# Altium schematic sheet 2_Button & Power.schdoc
size 497 x 243 mm; Name: A_A4; Symbol: A_A4; Device: A_Customize; @Project Name: Arduboy GamePlayer - Button &amp; Power; REV: 5.0; Date: 2022-04-23; Sheet: 2 /3; Draw By: LiLinBai; Company: FastLab Team; Convert to PCB: yes; Add into BOM: yes
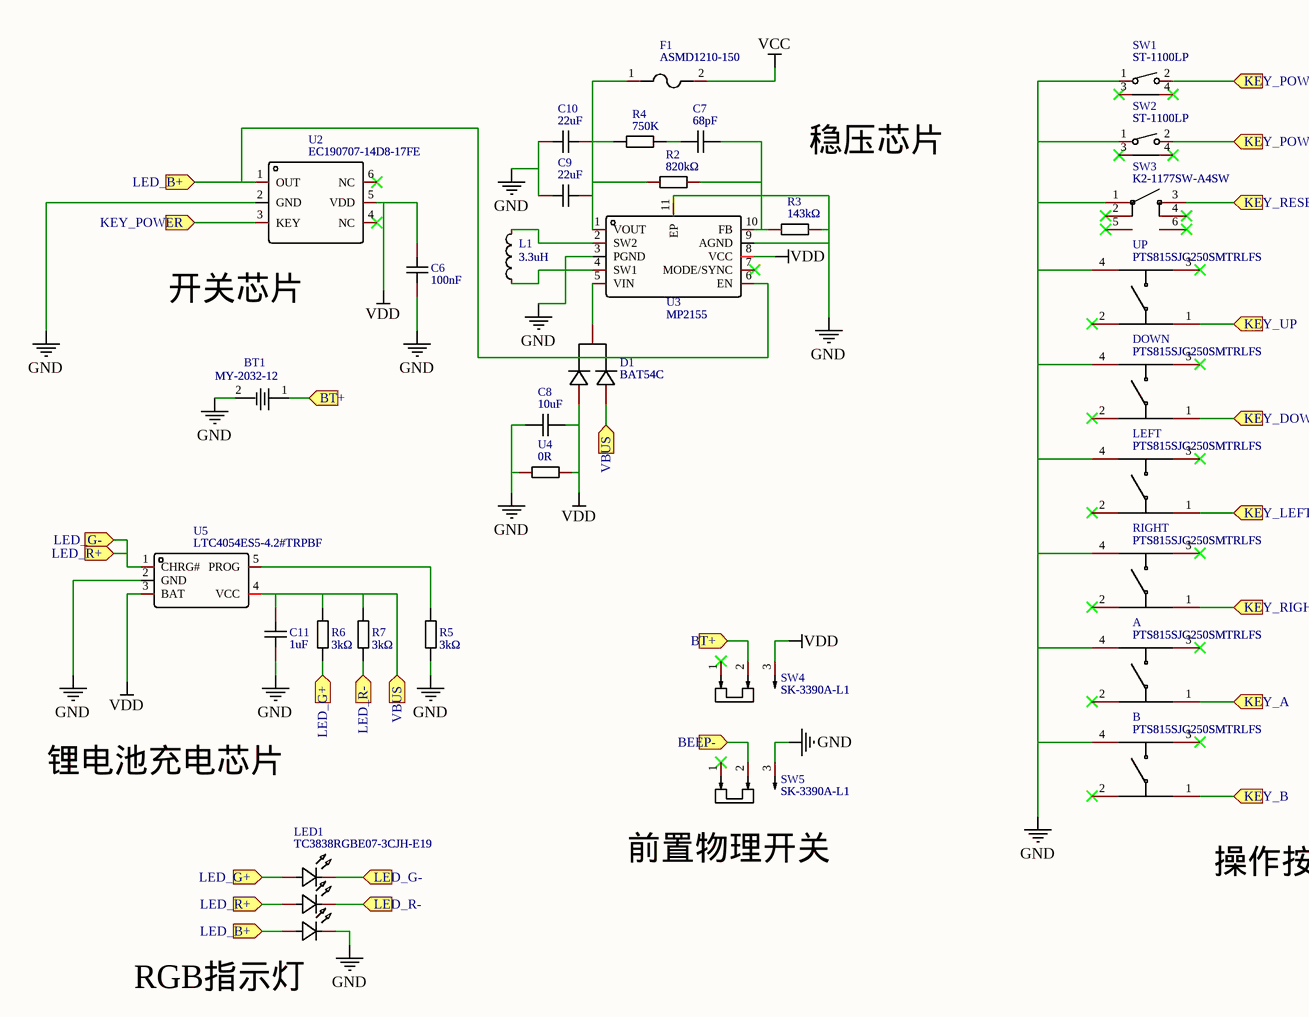
[diagram p0: 2_Button & Power.schdoc]

## Parts
A  PTS815SJG250SMTRLFS  [SW-SMD_4P-L4.2-W3.2-P2.15-LS4.6-1]
B  PTS815SJG250SMTRLFS  [SW-SMD_4P-L4.2-W3.2-P2.15-LS4.6-1]
BT1  MY-2032-12
C6  100nF  [C0603]
C7  68pF  [C0603]
C8  10uF  [C0603]
C9  22uF  [C0603]
C10  22uF  [C0603]
C11  1uF  [C0603]
D1  BAT54C  [SOT-23-3_L2.9-W1.6-P1.90-LS2.8-BR]
DOWN  PTS815SJG250SMTRLFS  [SW-SMD_4P-L4.2-W3.2-P2.15-LS4.6-1]
F1  ASMD1210-150  [F1210]
L1  3.3uH  [IND-SMD_L2.5-W2.0]
LED1  TC3838RGBE07-3CJH-E19  [LED-SMD_6P-L3.5-W3.5-BL]
LEFT  PTS815SJG250SMTRLFS  [SW-SMD_4P-L4.2-W3.2-P2.15-LS4.6-1]
R2  820kΩ  [R0603]
R3  143kΩ  [R0603]
R4  750K  [R0603]
R5  3kΩ  [R0603]
R6  3kΩ  [R0603]
R7  3kΩ  [R0603]
RIGHT  PTS815SJG250SMTRLFS  [SW-SMD_4P-L4.2-W3.2-P2.15-LS4.6-1]
SW1  ST-1100LP  [SW-SMD_ST-1100LP]
SW2  ST-1100LP  [SW-SMD_ST-1100LP]
SW3  K2-1177SW-A4SW  [KEY-SMD_K2-1177SW-A4DW-06]
SW4  SK-3390A-L1  [SW-SMD_SK-3390A-L1]
SW5  SK-3390A-L1  [SW-SMD_SK-3390A-L1]
U2  EC190707-14D8-17FE  [SOT-23-6_L2.9-W1.6-P0.95-LS2.8-BL]
U3  MP2155  [TDFN-10_L3.0-W3.0-P0.50-TL-EP]
U4  0R  [R0603]
U5  LTC4054ES5-4.2#TRPBF  [TSOT-23-5_L2.9-W1.6-P0.95-LS2.8-BL]
UP  PTS815SJG250SMTRLFS  [SW-SMD_4P-L4.2-W3.2-P2.15-LS4.6-1]

## Ports
BEEP- (in), BT+ (in), KEY_A (in), KEY_B (in), KEY_DOWN (in), KEY_LEFT (in), KEY_POWER (in), KEY_RESET (in), KEY_RIGHT (in), KEY_UP (in), LED_B+ (in), LED_G+ (in), LED_G- (in), LED_R+ (in), LED_R- (in), VBUS (in)

## Nets
GND: A.4 B.4 BT1.2 C6.1 C8.1 C9.1 C10.1 C11.1 DOWN.4 LED1.4(-) LEFT.4 R3.2 R5.1 RIGHT.4 SW1.1 SW2.1 SW3.1 SW5.3 U2.2(GND) U3.3(PGND) U3.9(AGND) U3.11(EP) U4.1 U5.2(GND) UP.4
VCC: F1.2
VDD: C6.2 C8.2 D1.1(A1) SW4.3 U2.5(VDD) U3.8(VCC) U4.2 U5.3(BAT)
BEEP-: SW5.2 ; port BEEP-
BT+: BT1.1 SW4.2 ; port BT+
KEY_A: A.1 ; port KEY_A
KEY_B: B.1 ; port KEY_B
KEY_DOWN: DOWN.1 ; port KEY_DOWN
KEY_LEFT: LEFT.1 ; port KEY_LEFT
KEY_POWER: SW1.2 SW2.2 U2.3(KEY) ; port KEY_POWER
KEY_RESET: SW3.3 ; port KEY_RESET
KEY_RIGHT: RIGHT.1 ; port KEY_RIGHT
KEY_UP: UP.1 ; port KEY_UP
LED_B+: LED1.3(+) U2.1(OUT) U3.6(EN) ; port LED_B+
LED_G+: LED1.1(+) R6.1 ; port LED_G+
LED_G-: LED1.2(+) LED1.6(-) U5.1(CHRG#) ; port LED_G-, port LED_R+
LED_R-: LED1.5(-) R7.1 ; port LED_R-
VBUS: C11.2 D1.2(A2) R6.2 R7.2 U5.4(VCC) ; port VBUS
NetC7_1: C7.1 R4.2
NetC7_2: C7.2 R2.2 R3.1 U3.10(FB)
NetC9_2: C9.2 C10.2 F1.1 R2.1 R4.1 U3.1(VOUT)
NetD1_3: D1.3(K) U3.5(VIN)
NetL1_1: L1.1 U3.4(SW1)
NetL1_2: L1.2 U3.2(SW2)
NetR5_2: R5.2 U5.5(PROG)

Not connected (* = marked no-connect by the designer): A 2* 3*; B 2* 3*; DOWN 2* 3*; LEFT 2* 3*; RIGHT 2* 3*; SW1 3* 4*; SW2 3* 4*; SW3 2* 4* 5* 6*; SW4 1*; SW5 1*; U2 4(NC)* 6(NC)*; U3 7(MODE/SYNC)*; UP 2* 3*

## Notes on the sheet
- 稳压芯片
- 开关芯片
- 锂电池充电芯片
- 前置物理开关
- 操作按键
- RGB指示灯
- 1
- 2
- 3
- 4
- 5
- A
- B
- C
- D
- TITLE:
- Arduboy GamePlayer - Button &amp; Power
- REV:
- 5.0
- Date:
- Company:
- 2022-04-23
- FastLab Team
- Drawn By:
- LiLinBai
- Sheet:
- 2 /3

## Library data of the parts
A B DOWN LEFT RIGHT UP = PTS815SJG250SMTRLFS: Manufacturer: C&K; Convert to PCB: yes; Name: PTS815SJG250SMTRLFS; Symbol: PTS815SJG250SMTRLFS; Device: PTS815SJG250SMTRLFS; Supplier: LCSC; Supplier Part: C411883; Manufacturer Part: PTS815SJG250SMTRLFS; JLCPCB Part Class: Extended Part; Add into BOM: yes; Origin Footprint: SW-SMD_4P-L4.2-W3.2-P2.15-LS4.6-1
BT1 = MY-2032-12: Manufacturer: MYOUNG(美阳); Convert to PCB: yes; Add into BOM: no; Origin Footprint: BAT-SMD_MY-2032-12; Name: MY-2032-12; Symbol: MY-2032-12; Device: MY-2032-12; Supplier: LCSC; Supplier Part: C964833; Manufacturer Part: MY-2032-12; JLCPCB Part Class: Extended Part
C6 = 0603B104K500: Manufacturer: WTC; Convert to PCB: yes; Name: 100nF; Symbol: 100nF; Device: 0603B104K500; Supplier: LCSC; Manufacturer Part: 0603B104K500; Supplier Part: C90807; JLCPCB Part Class: Extended Part; Add into BOM: yes; Origin Footprint: C0603
C7 = CC0603JRNPO9BN680: Manufacturer: YAGEO; Convert to PCB: yes; Name: 68pF; Symbol: 68pF; Device: CC0603JRNPO9BN680; Supplier: LCSC; Manufacturer Part: CC0603JRNPO9BN680; Supplier Part: C62782; JLCPCB Part Class: Extended Part; Add into BOM: yes; Origin Footprint: C0603
C8 = 0603X106K160NT: Manufacturer: FH; Convert to PCB: yes; Name: 10uF; Symbol: 10uF; Device: 0603X106K160NT; Supplier: LCSC; Manufacturer Part: 0603X106K160NT; Supplier Part: C70225; JLCPCB Part Class: Extended Part; Add into BOM: yes; Origin Footprint: C0603
C9 C10 = C0603X5R226M160NT: Manufacturer: SANYEAR(叁叶源); Convert to PCB: yes; Name: 22uF; Symbol: 22uF; Device: C0603X5R226M160NT; Supplier: LCSC; Supplier Part: C2835567; Manufacturer Part: C0603X5R226M160NT; JLCPCB Part Class: Extended Part; Add into BOM: yes; Origin Footprint: C0603
C11 = GRM188R61C105KA93D: Manufacturer: MuRata; Convert to PCB: yes; Name: 1uF; Symbol: 1uF; Device: GRM188R61C105KA93D; Supplier: LCSC; Manufacturer Part: GRM188R61C105KA93D; Supplier Part: C77404; JLCPCB Part Class: Extended Part; Add into BOM: yes; Origin Footprint: C0603
D1 = BAT54C: Manufacturer: CJ; Convert to PCB: yes; Name: BAT54C; Symbol: BAT54C; Device: BAT54C; Supplier: LCSC; Manufacturer Part: BAT54C; Supplier Part: C2135; JLCPCB Part Class: Extended Part; Add into BOM: yes; Origin Footprint: SOT-23-3_L2.9-W1.6-P1.90-LS2.8-BR
F1 = ASMD1210-150: Manufacturer: JDTFUSE; Convert to PCB: yes; Name: ASMD1210-150; Symbol: ASMD1210-150; Device: ASMD1210-150; Supplier: LCSC; Manufacturer Part: ASMD1210-150; Supplier Part: C135351; JLCPCB Part Class: Extended Part; Add into BOM: yes; Origin Footprint: F1210
L1 = CKCS252010-3.3uH/M: Manufacturer: CENKER; Convert to PCB: yes; Name: 3.3uH; Symbol: 3.3uH; Device: CKCS252010-3.3uH/M; Supplier: LCSC; Supplier Part: C354544; Manufacturer Part: CKCS252010-3.3uH/M; JLCPCB Part Class: Extended Part; Add into BOM: yes; Origin Footprint: IND-SMD_L2.5-W2.0
LED1 = TC3838RGBE07-3CJH-E19: Manufacturer: TCWIN; Convert to PCB: yes; Name: TC3838RGBE07-3CJH-E19; Symbol: TC3838RGBE07-3CJH-E19; Device: TC3838RGBE07-3CJH-E19; Supplier: LCSC; Supplier Part: C784547; Manufacturer Part: TC3838RGBE07-3CJH-E19; JLCPCB Part Class: Extended Part; Add into BOM: yes; Origin Footprint: LED-SMD_6P-L3.5-W3.5-BL
R2 = AECR0603F820KK9: Manufacturer: ResistorToday; Resistance: 820K; Convert to PCB: yes; Name: 820kΩ; Symbol: 820kΩ; Device: AECR0603F820KK9; Supplier: LCSC; Supplier Part: C352291; Manufacturer Part: AECR0603F820KK9; JLCPCB Part Class: Extended Part; Add into BOM: yes; Origin Footprint: R0603
R3 = RCT03143KFLF: Manufacturer: HKR; Resistance: 143K; Convert to PCB: yes; Name: 143kΩ; Symbol: 143kΩ; Device: RCT03143KFLF; Supplier: LCSC; Manufacturer Part: RCT03143KFLF; Supplier Part: C178124; JLCPCB Part Class: Extended Part; Add into BOM: yes; Origin Footprint: R0603
R4 = RC0603FR-07750KL: Manufacturer: YAGEO; Resistance: 750kΩ; Convert to PCB: yes; Name: 750K; Symbol: 750K; Device: RC0603FR-07750KL; Supplier: LCSC; Manufacturer Part: RC0603FR-07750KL; Supplier Part: C137684; JLCPCB Part Class: Extended Part; Add into BOM: yes; Origin Footprint: R0603
R5-R7 = RS-03K302JT: Manufacturer: FH; Resistance: 3K; Convert to PCB: yes; Name: 3kΩ; Symbol: 3kΩ; Device: RS-03K302JT; Supplier: LCSC; Manufacturer Part: RS-03K302JT; Supplier Part: C73812; JLCPCB Part Class: Extended Part; Add into BOM: yes; Origin Footprint: R0603
SW1 SW2 = ST-1100LP: Manufacturer: RI SHENG; Convert to PCB: yes; Name: ST-1100LP; Symbol: ST-1100LP; Device: ST-1100LP; Supplier: LCSC; Supplier Part: C589176; Manufacturer Part: ST-1100LP; JLCPCB Part Class: Extended Part; Add into BOM: yes; Origin Footprint: SW-SMD_ST-1100LP
SW3 = K2-1177SW-A4SW: Manufacturer: HRO; Convert to PCB: yes; Name: K2-1177SW-A4SW; Symbol: K2-1177SW-A4SW; Device: K2-1177SW-A4SW; Supplier: LCSC; Manufacturer Part: K2-1177SW-A4SW; Supplier Part: C92582; JLCPCB Part Class: Extended Part; Add into BOM: yes; Origin Footprint: KEY-SMD_K2-1177SW-A4DW-06
SW4 SW5 = SK-3390A-L1: Manufacturer: XKB Enterprise; Convert to PCB: yes; Name: SK-3390A-L1; Symbol: SK-3390A-L1; Device: SK-3390A-L1; Supplier: LCSC; Supplier Part: C319018; Manufacturer Part: SK-3390A-L1; JLCPCB Part Class: Extended Part; Add into BOM: yes; Origin Footprint: SW-SMD_SK-3390A-L1
U2 = TPMP2359DJ: Manufacturer: ADI; Convert to PCB: yes; Name: EC190707-14D8-17FE; Symbol: EC190707-14D8-17FE; Device: TPMP2359DJ; Supplier: LCSC; Supplier Part: 160AO; Manufacturer Part: TPMP2359DJ; JLCPCB Part Class: Extended Part; link: https://item.taobao.com/item.htm?spm=a230r.1.14.8.592e94cajrAXeN&amp;id=608102655105&amp;ns=1&amp;abbucket=8#detail; Add into BOM: yes; Origin Footprint: SOT-23-6_L2.9-W1.6-P0.95-LS2.8-BL
U3 = MP2155: Manufacturer: null; Convert to PCB: yes; Name: MP2155; Symbol: MP2155; Device: MP2155; Supplier: LCSC; Supplier Part: C9900008573; Manufacturer Part: MP2155; JLCPCB Part Class: Extended Part; Add into BOM: yes; Origin Footprint: TDFN-10_L3.0-W3.0-P0.50-TL-EP
U4 = 0R: Manufacturer: null; Convert to PCB: yes; Name: 0R; Symbol: 0R; Device: 0R; Supplier: LCSC; Supplier Part: C9900012830; Manufacturer Part: 0R; JLCPCB Part Class: Extended Part; Add into BOM: yes; Origin Footprint: R0603
U5 = LTC4054ES5-4.2#TRPBF: Manufacturer: ADI(亚德诺)/LINEAR; Convert to PCB: yes; Name: LTC4054ES5-4.2#TRPBF; Symbol: LTC4054ES5-4.2#TRPBF; Device: LTC4054ES5-4.2#TRPBF; Supplier: LCSC; Supplier Part: C462648; Manufacturer Part: LTC4054ES5-4.2#TRPBF; JLCPCB Part Class: Extended Part; Add into BOM: yes; Origin Footprint: TSOT-23-5_L2.9-W1.6-P0.95-LS2.8-BL